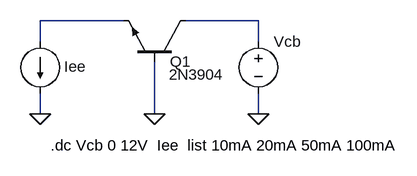
[diagram p0: schematic cb-output.asc]
cb-output.asc, the LTspice schematic file:
Version 4
SHEET 1 880 680
WIRE 160 112 32 112
WIRE 368 112 256 112
WIRE 32 144 32 112
WIRE 368 144 368 112
WIRE 32 256 32 224
WIRE 208 256 208 176
WIRE 368 256 368 224
FLAG 208 256 0
FLAG 32 256 0
FLAG 368 256 0
SYMBOL voltage 368 128 R0
WINDOW 3 24 32 Invisible 2
WINDOW 123 0 0 Left 2
WINDOW 39 0 0 Left 2
SYMATTR Value 0
SYMATTR InstName Vcb
SYMBOL npn 256 176 M270
WINDOW 0 1 24 VLeft 2
WINDOW 3 -19 26 VLeft 2
SYMATTR InstName Q1
SYMATTR Value 2N3904
SYMBOL current 32 144 R0
WINDOW 0 37 39 Left 2
WINDOW 3 24 0 Invisible 2
WINDOW 123 0 0 Left 2
WINDOW 39 0 0 Left 2
SYMATTR InstName Iee
SYMATTR Value 0
TEXT 48 304 Left 2 !.dc Vcb 0 12V  Iee  list 10mA 20mA 50mA 100mA

The netlist it stands for:
* cb-output.asc
Vcb N002 0 0
Q1 N002 0 N001 0 2N3904
Iee N001 0 0
.model NPN NPN
.model PNP PNP
.lib standard.bjt
.dc Vcb 0 12V  Iee  list 10mA 20mA 50mA 100mA
.backanno
.end